# Altium project FPGA_ADC_SHIELD_PCB2.PrjPcb
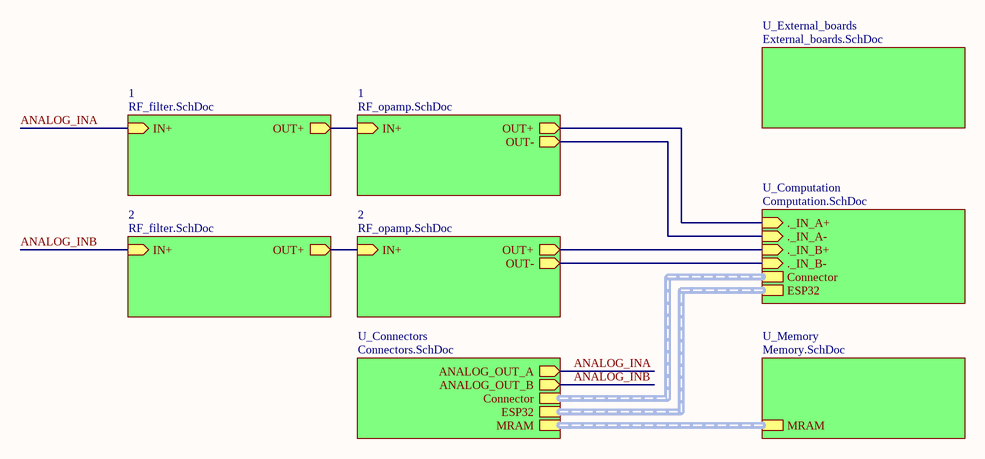
[diagram p0: Main.SchDoc]
7 sheets, 94 parts. Net scope: hierarchical (ports join the sheet entries above them; power ports are global).
Board file: MainBoard.PcbDoc
Sheets:
  Main.SchDoc
    1 = RF_filter.SchDoc
    1 = RF_opamp.SchDoc
    2 = RF_filter.SchDoc
    2 = RF_opamp.SchDoc
    U_Connectors = Connectors.SchDoc
    U_Computation = Computation.SchDoc
    U_Memory = Memory.SchDoc
    U_External_boards = External_boards.SchDoc

## Sheet Main.SchDoc
size A4; SheetNumber: 1; SheetTotal: 7

### Sub-sheets
1 = RF_filter.SchDoc: IN+ (in), OUT+ (out)
1 = RF_opamp.SchDoc: IN+ (in), OUT+ (out), OUT- (out)
2 = RF_filter.SchDoc: IN+ (in), OUT+ (out)
2 = RF_opamp.SchDoc: IN+ (in), OUT+ (out), OUT- (out)
U_Computation = Computation.SchDoc: ._IN_B+ (in), ._IN_B- (in), ._IN_A+ (in), ._IN_A- (in), Connector (harness Connector), ESP32 (harness *)
U_Connectors = Connectors.SchDoc: ANALOG_OUT_A (out), ANALOG_OUT_B (out), Connector (harness Connector), MRAM (harness MRAM), ESP32 (harness *)
U_External_boards = External_boards.SchDoc: no entries
U_Memory = Memory.SchDoc: MRAM (harness MRAM)

### Nets
ANALOG_INA: sheet 1/IN+, sheet U_Connectors/ANALOG_OUT_A
ANALOG_INB: sheet 2/IN+, sheet U_Connectors/ANALOG_OUT_B
NetC24_1_2: sheet 1/OUT+, sheet 1/IN+
NetC24_2_2: sheet 2/OUT+, sheet 2/IN+
NetC25_1_1: sheet 1/OUT+, sheet U_Computation/._IN_A+
NetC25_2_1: sheet 2/OUT+, sheet U_Computation/._IN_B+
NetC26_1_2: sheet 1/OUT-, sheet U_Computation/._IN_A-
NetC26_2_2: sheet 2/OUT-, sheet U_Computation/._IN_B-

### Buses and harness runs
harness sheet U_Computation/Connector = sheet U_Connectors/Connector
harness sheet U_Computation/ESP32 = sheet U_Connectors/ESP32
harness sheet U_Connectors/MRAM = sheet U_Memory/MRAM

## Sheet RF_filter.SchDoc
size A4; SheetNumber: 4; SheetTotal: 7
Used 2 times, as channels 1, 2. Parts and nets are listed once, with the designators drawn on the sheet.
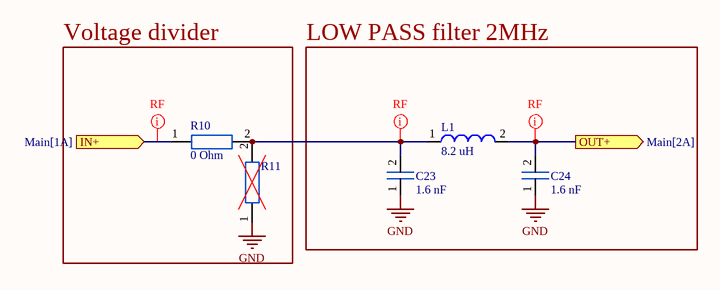
[diagram p1: RF_filter.SchDoc]

### Parts
C23  1.6 nF  [0402_footprint]
C24  1.6 nF  [0402_footprint]
L1  8.2 uH  [0603_FOOTPRINT]
R10  0 Ohm  [0402_footprint]
R11  (no value)  [0402_footprint]

### Blocks framed on the sheet
Voltage divider: R10 R11
LOW PASS filter 2MHz: C23 C24 L1

### Ports
IN+ (in, see Main[1A]), OUT+ (out, see Main[2A])

### Nets
GND: C23.1 C24.1 R11.1
IN+: R10.1 ; port IN+
OUT+: C24.2 L1.2 ; port OUT+
NetC23_2: C23.2 L1.1 R10.2 R11.2

### Channels
1: designators end in _1; ports IN+=ANALOG_INA OUT+=NetC24_1_2
2: designators end in _2; ports IN+=ANALOG_INB OUT+=NetC24_2_2

### Layout directives
net class RF: ANALOG_INA, NetC23_1_2, NetC24_1_2

### Library data of the parts
C23 C24 = Capacitor_0402: 0402 capacitor
L1 = Inductor_0603: 0603 inductor
R10 R11 = Resistor_0402

## Sheet RF_opamp.SchDoc
size A4; SheetNumber: 5; SheetTotal: 7
Used 2 times, as channels 1, 2. Parts and nets are listed once, with the designators drawn on the sheet.
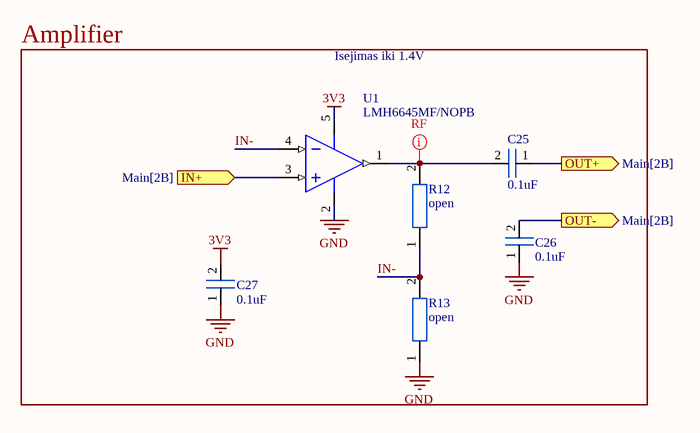
[diagram p2: RF_opamp.SchDoc]

### Parts
C25  0.1uF  [0402_footprint]
C26  0.1uF  [0402_footprint]
C27  0.1uF  [0402_footprint]
R12  open  [0402_footprint]
R13  open  [0402_footprint]
U1  LMH6645MF/NOPB  [DBV0005A_N]

### Ports
IN+ (in, see Main[2B]), OUT+ (out, see Main[2B]), OUT- (out, see Main[2B])

### Nets
3V3: C27.2 U1.5(V+)
GND: C26.1 C27.1 R13.1 U1.2(V-)
IN+: U1.3(IN+) ; port IN+
IN-: R12.1 R13.2 U1.4(IN-)
OUT+: C25.1 ; port OUT+
OUT-: C26.2 ; port OUT-
NetC25_2: C25.2 R12.2 U1.1(OUT)

### Channels
1: designators end in _1; ports IN+=NetC24_1_2 OUT+=NetC25_1_1 OUT-=NetC26_1_2
2: designators end in _2; ports IN+=NetC24_2_2 OUT+=NetC25_2_1 OUT-=NetC26_2_2

### Layout directives
net class RF: NetC25_1_2

### Notes on the sheet
- Amplifier
- Isejimas iki 1.4V

### Library data of the parts
C25-C27 = Capacitor_0402: 0402 capacitor
R12 R13 = Resistor_0402
U1 = CMP-0055-01245-3: 2.7V, 650uA, 65MHz, Rail-to-Rail Input and Output Amplifiers with Shutdown Option, 5-pin SOT-23, Pb-Free; Manufacturer: Texas Instruments; PowerWise: Y; PackageTopMarking: A68A*XTT; Package Reference: DBV0005A; PackageDescription: Molded SOT-23, .115 x .063 x .040 in Body, 5 Lead, .0375 in Pitch; ComponentLink1URL: http://www.ti.com/general/docs/lit/getliterature.tsp?genericPartNumber=LMH6645&fileType=pdf; CompType: Amplifiers; PinCount: 5; RoHS: Y; ComponentLink1Description: Datasheet URL

## Sheet Connectors.SchDoc
size A4; SheetNumber: 2; SheetTotal: 7
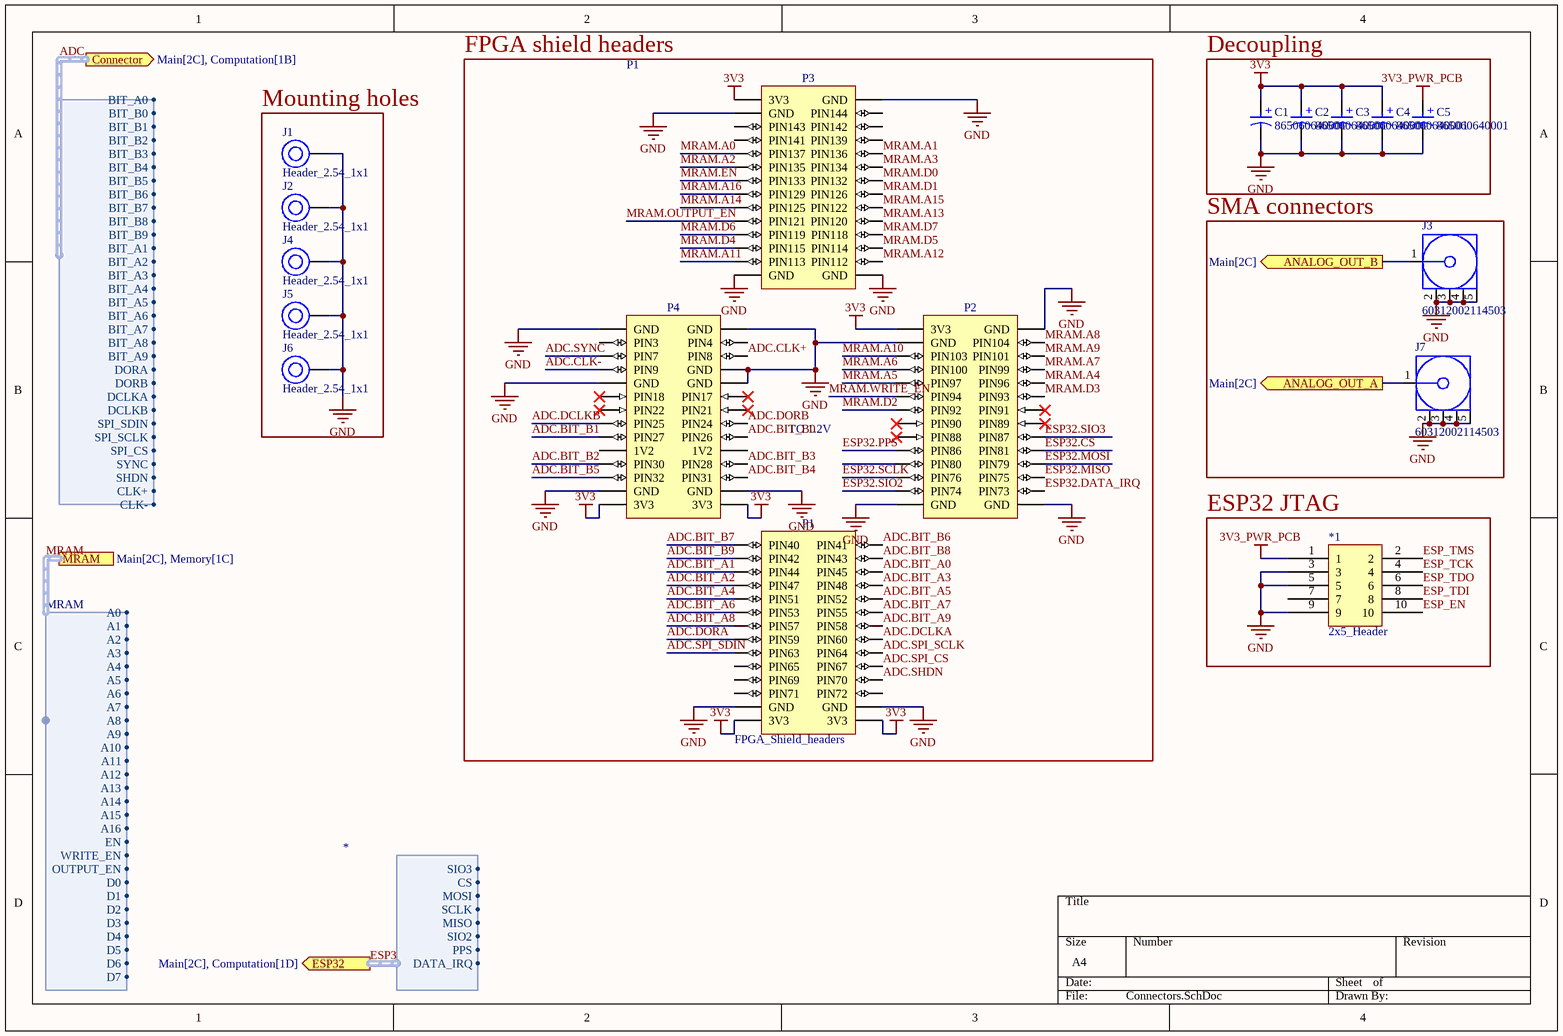
[diagram p3: Connectors.SchDoc]

### Parts
*1  2x5_Header  [2x5_HEADER]
C1  865060640001  [WCAP-ASLL_D4H5.5]
C2  865060640001  [WCAP-ASLL_D4H5.5]
C3  865060640001  [WCAP-ASLL_D4H5.5]
C4  865060640001  [WCAP-ASLL_D4H5.5]
C5  865060640001  [WCAP-ASLL_D4H5.5]
J1  Header_2.54_1x1  [HEADER_2.54_1x1]
J2  Header_2.54_1x1  [HEADER_2.54_1x1]
J3  60312002114503  [60312002114503]
J4  Header_2.54_1x1  [HEADER_2.54_1x1]
J5  Header_2.54_1x1  [HEADER_2.54_1x1]
J6  Header_2.54_1x1  [HEADER_2.54_1x1]
J7  60312002114503  [60312002114503]
P1  FPGA_Shield_headers  [FPGA_SHIELD_HEADER_FOOTPRINT]

### Blocks framed on the sheet
FPGA shield headers: P1
Decoupling: C1-C5
Mounting holes: J1 J2 J4-J6
SMA connectors: J3 J7
ESP32 JTAG: *1

### Ports
ANALOG_OUT_A (out, see Main[2C]), ANALOG_OUT_B (out, see Main[2C]), Connector (out, harness Connector, see Main[2C], Computation[1B]), ESP32 (out, harness *, see Main[2C], Computation[1D]), MRAM (harness MRAM, see Main[2C], Memory[1C])

### Harnesses
Connector: BIT_B1, BIT_B2, BIT_B3, BIT_B4, BIT_B5, BIT_B6, BIT_B7, BIT_B8, BIT_B9, BIT_A1, BIT_A2, BIT_A3, BIT_A4, BIT_A5, BIT_A6, BIT_A7, BIT_A8, BIT_A9, DORA, DORB, DCLKA, DCLKB, SPI_SDIN, SPI_SCLK, SPI_CS, SYNC, SHDN, BIT_B0, BIT_A0, CLK+, CLK-
MRAM: A0, A1, A2, A3, A4, A5, A6, A7, A8, A9, A10, A11, A12, A13, A14, A15, A16, EN, WRITE_EN, OUTPUT_EN, D0, D1, D2, D3, D4, D5, D6, D7
*: SIO3, CS, MOSI, SCLK, MISO, SIO2, PPS, DATA_IRQ

### Nets
3V3: C1.1(P) C2.1(P) C3.1(P) C4.1(P) P1.27(3V3) P1.28(3V3) P1.29(3V3) P1.57(3V3) P1.111(3V3) P1.112(3V3)
3V3_PWR_PCB: *1.1 C5.1(P)
GND: *1.3 *1.5 *1.9 C1.2(N) C2.2(N) C3.2(N) C4.2(N) C5.2(N) J1.0 J2.0 J3.2(GND) J3.3(GND) J3.4(GND) J3.5(GND) J4.0 J5.0 J6.0 J7.2(GND) J7.3(GND) J7.4(GND) J7.5(GND) P1.1(GND) P1.2(GND) P1.8(GND) P1.9(GND) P1.10(GND) P1.25(GND) P1.26(GND) P1.30(GND) P1.31(GND) P1.55(GND) P1.56(GND) P1.58(GND) P1.59(GND) P1.83(GND) P1.84(GND) P1.109(GND) P1.110(GND)
ADC.BIT_A0: P1.90(PIN45)
ADC.BIT_A1: P1.89(PIN44)
ADC.BIT_A2: P1.91(PIN47)
ADC.BIT_A3: P1.92(PIN48)
ADC.BIT_A4: P1.93(PIN51)
ADC.BIT_A5: P1.94(PIN52)
ADC.BIT_A6: P1.95(PIN53)
ADC.BIT_A7: P1.96(PIN55)
ADC.BIT_A8: P1.97(PIN57)
ADC.BIT_A9: P1.98(PIN58)
ADC.BIT_B0: P1.18(PIN26)
ADC.BIT_B1: P1.17(PIN27)
ADC.BIT_B2: P1.21(PIN30)
ADC.BIT_B3: P1.22(PIN28)
ADC.BIT_B4: P1.24(PIN31)
ADC.BIT_B5: P1.23(PIN32)
ADC.BIT_B6: P1.86(PIN41)
ADC.BIT_B7: P1.85(PIN40)
ADC.BIT_B8: P1.88(PIN43)
ADC.BIT_B9: P1.87(PIN42)
ADC.CLK+: P1.6(PIN8)
ADC.CLK-: P1.7(PIN9)
ADC.DCLKA: P1.100(PIN60)
ADC.DCLKB: P1.15(PIN25)
ADC.DORA: P1.99(PIN59)
ADC.DORB: P1.16(PIN24)
ADC.SHDN: P1.106(PIN70)
ADC.SPI_CS: P1.104(PIN67)
ADC.SPI_SCLK: P1.102(PIN64)
ADC.SPI_SDIN: P1.101(PIN63)
ADC.SYNC: P1.5(PIN7)
ANALOG_INA: J7.1(Signal) ; port ANALOG_OUT_A
ANALOG_INB: J3.1(Signal) ; port ANALOG_OUT_B
ESP32.CS: P1.76(PIN81)
ESP32.DATA_IRQ: P1.82(PIN73)
ESP32.MISO: P1.80(PIN75)
ESP32.MOSI: P1.78(PIN79)
ESP32.PPS: P1.75(PIN86)
ESP32.SCLK: P1.79(PIN76)
ESP32.SIO2: P1.81(PIN74)
ESP32.SIO3: P1.74(PIN87)
ESP_EN: *1.10
ESP_TCK: *1.4
ESP_TDI: *1.8
ESP_TDO: *1.6
ESP_TMS: *1.2
MRAM.A0: P1.37(PIN137)
MRAM.A1: P1.38(PIN136)
MRAM.A2: P1.39(PIN135)
MRAM.A3: P1.40(PIN134)
MRAM.A4: P1.66(PIN96)
MRAM.A5: P1.65(PIN97)
MRAM.A6: P1.63(PIN100)
MRAM.A7: P1.64(PIN99)
MRAM.A8: P1.60(PIN104)
MRAM.A9: P1.62(PIN101)
MRAM.A10: P1.61(PIN103)
MRAM.A11: P1.53(PIN113)
MRAM.A12: P1.54(PIN112)
MRAM.A13: P1.48(PIN120)
MRAM.A14: P1.45(PIN125)
MRAM.A15: P1.46(PIN122)
MRAM.A16: P1.43(PIN129)
MRAM.D0: P1.42(PIN132)
MRAM.D1: P1.44(PIN126)
MRAM.D2: P1.69(PIN92)
MRAM.D3: P1.68(PIN93)
MRAM.D4: P1.51(PIN115)
MRAM.D5: P1.52(PIN114)
MRAM.D6: P1.49(PIN119)
MRAM.D7: P1.50(PIN118)
MRAM.EN: P1.41(PIN133)
MRAM.OUTPUT_EN: P1.47(PIN121)
MRAM.WRITE_EN: P1.67(PIN94)

Not connected (* = marked no-connect by the designer): *1 7; P1 3(PIN3) 4(PIN4) 11(PIN18)* 12(PIN17)* 13(PIN22)* 14(PIN21)* 19(1V2) 20(1V2) 32(PIN144) 33(PIN143) 34(PIN142) 35(PIN141) 36(PIN139) 70(PIN91)* 71(PIN90)* 72(PIN89)* 73(PIN88)* 77(PIN80) 103(PIN65) 105(PIN69) 107(PIN71) 108(PIN72)

### Buses and harness runs
harness ADC = port Connector
harness ESP32 = port ESP32
harness MRAM = port MRAM

### Notes on the sheet
- (near P1) TO 1.2V
- (in symbol CMP-03913-53914524-1) +

### Library data of the parts
C1-C5 = CMP-03913-53914524-1: 865060640001 WCAP-ASLL Aluminum Electrolytic Capacitors; Life (Hours): 2000hours; Polarity: Polar; Voltage Rating: 50V; Leakage Current: 3µA; Capacitance: 1µF; Ripple Current: 60mA; Tolerance: 20%; Insulation Resistance: 16.6667MΩ; Impedance: 4.4Ω; Min Operating Temperature: -55°C; NexarPartId: 53914524; Height - Seated (Max): 5.5118mm; Height: 5.5mm; Max Operating Temperature: 105°C; Length: 5.5mm; RoHS: Compliant; Voltage Rating (DC): 50V; Mount: Surface Mount; Ripple Current (AC): 60mA; Case/Package: Radial; Packaging: Tape & Reel (TR); Diameter: 4mm; REACH SVHC: Unknown
  C1: ComponentLink1Description: Buy; ComponentLink1URL: https://www.we-online.com/en/components/products/WCAP-ASLL#/articles/WCAP_ASLL_SIZE_4
J1 J2 J4-J6 = Header_2.54_1x1: Header 1x1
J3 J7 = CMP-207975-000002-2: SMA PCB THT JACK STRAIGHT WR-SMA; NexarPartId: 97004423; Insertion Loss (dB): 0.14dB; Number of Contacts: 1; Voltage Rating: 335V; Impedance: 50Ω; Frequency: 18GHz; Dielectric Material: PTFE; Insulation Resistance: 5GΩ; Orientation: Straight; Contact Material: Gold, Nickel; Min Operating Temperature: -65°C; Insulation Material: PTFE; Connector Type: SMA; Max Operating Temperature: 165°C; Height: 9.76mm

## Sheet Computation.SchDoc
size A4; SheetNumber: 3; SheetTotal: 7
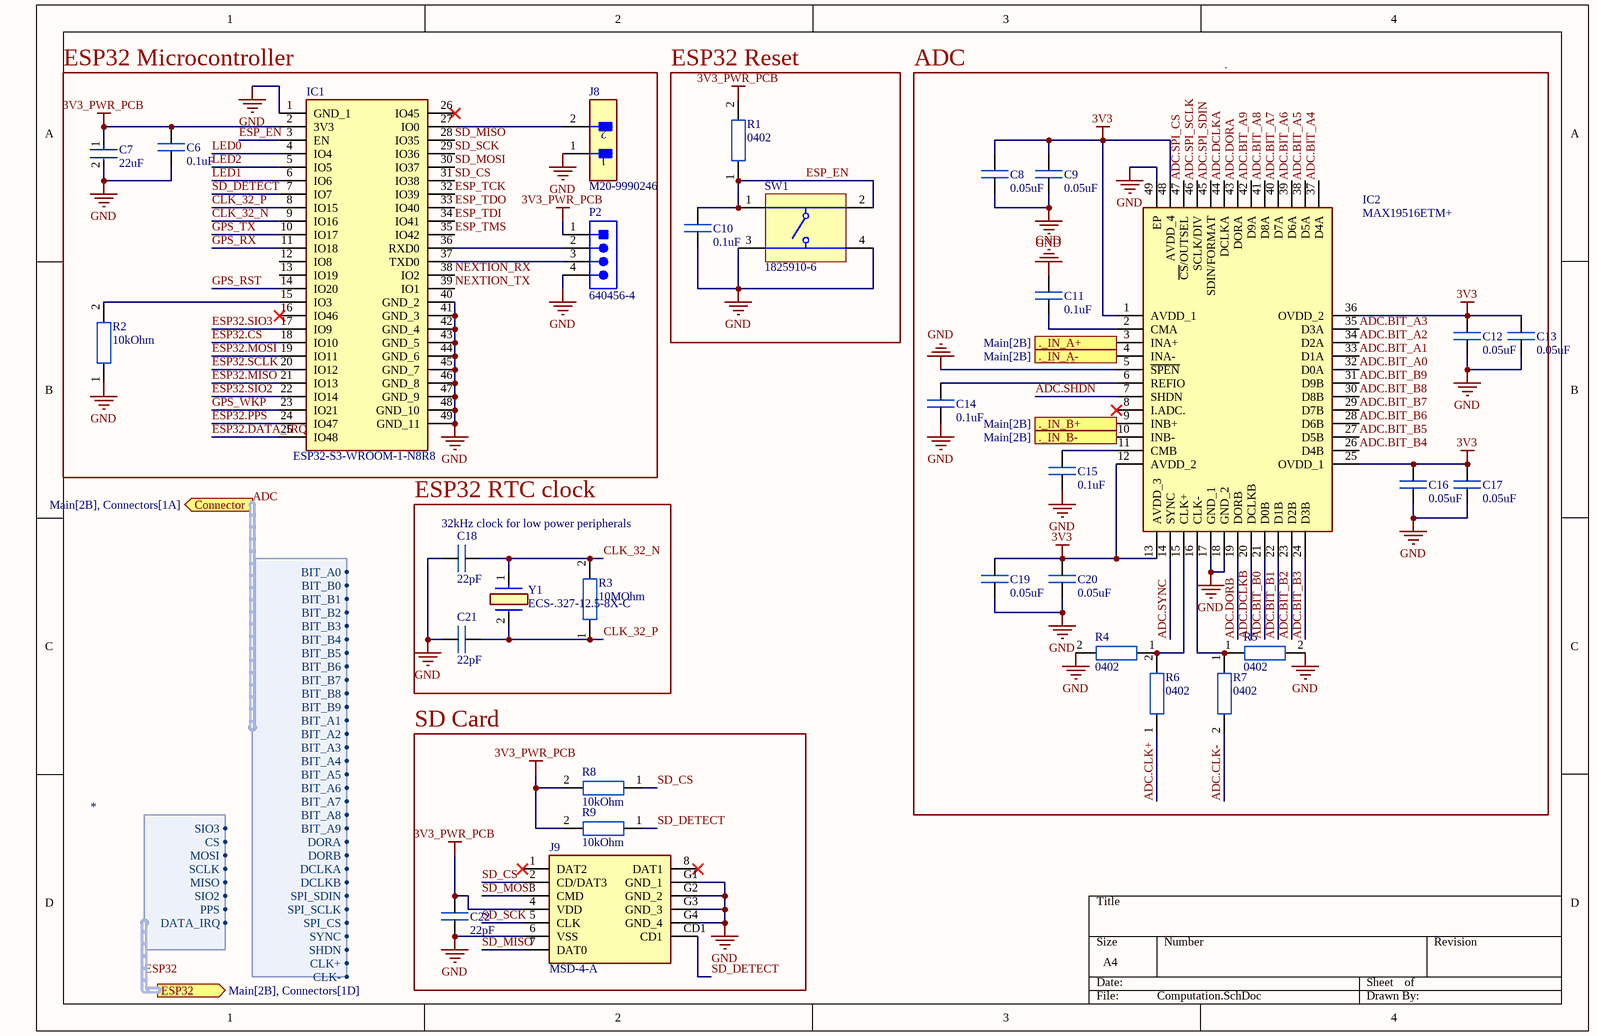
[diagram p4: Computation.SchDoc]

### Parts
C6  0.1uF  [0402_footprint]
C7  22uF  [FP-CL21-IPC_B]
C8  0.05uF  [0402_footprint]
C9  0.05uF  [0402_footprint]
C10  0.1uF  [0402_footprint]
C11  0.1uF  [0402_footprint]
C12  0.05uF  [0402_footprint]
C13  0.05uF  [0402_footprint]
C14  0.1uF  [0402_footprint]
C15  0.1uF  [0402_footprint]
C16  0.05uF  [0402_footprint]
C17  0.05uF  [0402_footprint]
C18  22pF  [0402_footprint]
C19  0.05uF  [0402_footprint]
C20  0.05uF  [0402_footprint]
C21  22pF  [0402_footprint]
C22  22pF  [0402_footprint]
IC1  ESP32-S3-WROOM-1-N8R8  [ESP32S3WROOM1N8R8]
IC2  MAX19516ETM+  [QFN50P700X700X80-49N]
J8  M20-9990246  [FP-M20-9990246-MFG]
J9  MSD-4-A  [MSD4A]
P2  640456-4  [TECO-640456-4]
R1  0402  [0402_footprint]
R2  10kOhm  [0402_footprint]
R3  10MOhm  [0402_footprint]
R4  0402  [0402_footprint]
R5  0402  [0402_footprint]
R6  0402  [0402_footprint]
R7  0402  [0402_footprint]
R8  10kOhm  [0402_footprint]
R9  10kOhm  [0402_footprint]
SW1  1825910-6  [TECO-1825910-6_V]
Y1  ECS-.327-12.5-8X-C  [ECS3271258XC]

### Blocks framed on the sheet
ESP32 Microcontroller: C6 C7 IC1 J8 P2 R2
ESP32 Reset: C10 R1 SW1
ADC: C8 C9 C11-C17 C19 C20 IC2 R4-R7
ESP32 RTC clock: C18 C21 R3 Y1
SD Card: C22 J9 R8 R9

### Ports
._IN_A+ (in, see Main[2B]), ._IN_A- (in, see Main[2B]), ._IN_B+ (in, see Main[2B]), ._IN_B- (in, see Main[2B]), Connector (out, harness Connector, see Main[2B], Connectors[1A]), ESP32 (out, harness *, see Main[2B], Connectors[1D])

### Harnesses
Connector: BIT_B1, BIT_B2, BIT_B3, BIT_B4, BIT_B5, BIT_B6, BIT_B7, BIT_B8, BIT_B9, BIT_A1, BIT_A2, BIT_A3, BIT_A4, BIT_A5, BIT_A6, BIT_A7, BIT_A8, BIT_A9, DORA, DORB, DCLKA, DCLKB, SPI_SDIN, SPI_SCLK, SPI_CS, SYNC, SHDN, BIT_B0, BIT_A0, CLK+, CLK-
*: SIO3, CS, MOSI, SCLK, MISO, SIO2, PPS, DATA_IRQ

### Nets
3V3: C8.2 C9.2 C12.2 C13.2 C16.2 C17.2 C19.2 C20.2 IC2.1(AVDD_1) IC2.12(AVDD_2) IC2.13(AVDD_3) IC2.25(OVDD_1) IC2.36(OVDD_2) IC2.48(AVDD_4)
3V3_PWR_PCB: C6.2 C7.1 C22.1 IC1.2(3V3) J9.4(VDD) P2.1 R1.2 R8.2 R9.2
GND: C6.1 C7.2 C8.1 C9.1 C10.1 C11.2 C12.1 C13.1 C14.1 C15.1 C16.1 C17.1 C18.2 C19.1 C20.1 C21.2 C22.2 IC1.1(GND_1) IC1.40(GND_2) IC1.41(GND_3) IC1.42(GND_4) IC1.43(GND_5) IC1.44(GND_6) IC1.45(GND_7) IC1.46(GND_8) IC1.47(GND_9) IC1.48(GND_10) IC1.49(GND_11) IC2.5(~{SPEN}) IC2.17(GND_1) IC2.18(GND_2) IC2.49(EP) J8.1 J9.6(VSS) J9.G1(GND_1) J9.G2(GND_2) J9.G3(GND_3) J9.G4(GND_4) P2.4 R2.1 R4.2 R5.2 SW1.3 SW1.4
ADC.BIT_A0: IC2.32(D0A)
ADC.BIT_A1: IC2.33(D1A)
ADC.BIT_A2: IC2.34(D2A)
ADC.BIT_A3: IC2.35(D3A)
ADC.BIT_A4: IC2.37(D4A)
ADC.BIT_A5: IC2.38(D5A)
ADC.BIT_A6: IC2.39(D6A)
ADC.BIT_A7: IC2.40(D7A)
ADC.BIT_A8: IC2.41(D8A)
ADC.BIT_A9: IC2.42(D9A)
ADC.BIT_B0: IC2.21(D0B)
ADC.BIT_B1: IC2.22(D1B)
ADC.BIT_B2: IC2.23(D2B)
ADC.BIT_B3: IC2.24(D3B)
ADC.BIT_B4: IC2.26(D4B)
ADC.BIT_B5: IC2.27(D5B)
ADC.BIT_B6: IC2.28(D6B)
ADC.BIT_B7: IC2.29(D7B)
ADC.BIT_B8: IC2.30(D8B)
ADC.BIT_B9: IC2.31(D9B)
ADC.CLK+: R6.1
ADC.CLK-: R7.2
ADC.DCLKA: IC2.44(DCLKA)
ADC.DCLKB: IC2.20(DCLKB)
ADC.DORA: IC2.43(DORA)
ADC.DORB: IC2.19(DORB)
ADC.SHDN: IC2.7(SHDN)
ADC.SPI_CS: IC2.47(~{CS}/OUTSEL)
ADC.SPI_SCLK: IC2.46(SCLK/DIV)
ADC.SPI_SDIN: IC2.45(SDIN/FORMAT)
ADC.SYNC: IC2.14(SYNC)
CLK_32_N: C18.1 IC1.9(IO16) R3.2 Y1.1(X1)
CLK_32_P: C21.1 IC1.8(IO15) R3.1 Y1.2(X2)
ESP32.CS: IC1.18(IO10)
ESP32.DATA_IRQ: IC1.25(IO48)
ESP32.MISO: IC1.21(IO13)
ESP32.MOSI: IC1.19(IO11)
ESP32.PPS: IC1.24(IO47)
ESP32.SCLK: IC1.20(IO12)
ESP32.SIO2: IC1.22(IO14)
ESP32.SIO3: IC1.17(IO9)
ESP_EN: C10.2 IC1.3(EN) R1.1 SW1.1 SW1.2
ESP_TCK: IC1.32(IO39)
ESP_TDI: IC1.34(IO41)
ESP_TDO: IC1.33(IO40)
ESP_TMS: IC1.35(IO42)
GPS_RST: IC1.14(IO20)
GPS_RX: IC1.11(IO18)
GPS_TX: IC1.10(IO17)
GPS_WKP: IC1.23(IO21)
LED0: IC1.4(IO4)
LED1: IC1.6(IO6)
LED2: IC1.5(IO5)
NEXTION_RX: IC1.38(IO2)
NEXTION_TX: IC1.39(IO1)
SD_CS: IC1.31(IO38) J9.2(CD/DAT3) R8.1
SD_DETECT: IC1.7(IO7) J9.CD1 R9.1
SD_MISO: IC1.28(IO35) J9.7(DAT0)
SD_MOSI: IC1.30(IO37) J9.3(CMD)
SD_SCK: IC1.29(IO36) J9.5(CLK)
NetC11_1: C11.1 IC2.2(CMA)
NetC14_2: C14.2 IC2.6(REFIO)
NetC15_2: C15.2 IC2.11(CMB)
NetC25_1_1: IC2.3(INA+) ; port ._IN_A+
NetC25_2_1: IC2.9(INB+) ; port ._IN_B+
NetC26_1_2: IC2.4(INA-) ; port ._IN_A-
NetC26_2_2: IC2.10(INB-) ; port ._IN_B-
NetIC1_15: IC1.15(IO3) R2.2
NetIC1_27: IC1.27(IO0) J8.2
NetIC1_36: IC1.36(RXD0) P2.2
NetIC1_37: IC1.37(TXD0) P2.3
NetIC2_15: IC2.15(CLK+) R4.1 R6.2
NetIC2_16: IC2.16(CLK-) R5.1 R7.1

Not connected (* = marked no-connect by the designer): IC1 12(IO8) 13(IO19) 16(IO46)* 26(IO45)*; IC2 8(I.ADC.)*; J9 1(DAT2)* 8(DAT1)*

### Buses and harness runs
harness ADC = port Connector
harness ESP32 = port ESP32

### Notes on the sheet
- .
- (near C18) 32kHz clock for low power peripherals

### Library data of the parts
C6 C8-C22 = Capacitor_0402: 0402 capacitor
C7 = CMP-13271-002087-1: CL21 Series 0805 22uF 6.3V ±20% Tolerance X5R Multilayer Ceramic Chip Capacitor; Max Operating Temperature: 85°C; Voltage Rating (DC): 6.3V; Thickness: 0.055inch; Packaging: Tape and Reel; Min Operating Temperature: -55°C; Depth: 1.25mm; Case/Package: 0805; Length: 2mm; Mount: Surface Mount; Width: 0.049inch; Radiation Hardening: No; Voltage Rating: 6.3V; Height: 1.25mm; Tolerance: 20%; Lead Free: Lead Free; Capacitance: 22uF; Package Quantity: 10000; Dielectric: X5R; ComponentLink1Description: Buy; ComponentLink1URL: https://www.mouser.lt/ProductDetail/Samsung-Electro-Mechanics/CL21A226MQQNNNF?qs=sGAEpiMZZMt7gvpyg0xT8gpCc%252Bo5qKWQjwV5CjV5FSg%3D
IC1 = ESP32-S3-WROOM-1-N8R8: Integrated Circuit; Manufacturer_Name: Espressif Systems; Datasheet Link: https://www.espressif.com/sites/default/files/documentation/esp32-s3-wroom-1_wroom-1u_datasheet_en.pdf; Height: 3.25mm; Manufacturer_Part_Number: ESP32-S3-WROOM-1-N8R8; Mouser Part Number: 356-EP32S3WROOM1N8R8; Mouser Price/Stock: https://www.mouser.co.uk/ProductDetail/Espressif-Systems/ESP32-S3-WROOM-1-N8R8?qs=7D1LtPJG0i3%2F28hKFavOpQ%3D%3D; ComponentLink1Description: S3 datasheet; ComponentLink1URL: https://www.espressif.com/sites/default/files/documentation/esp32-s3_datasheet_en.pdf; ComponentLink2Description: Wroom datasheet; ComponentLink2URL: https://www.espressif.com/sites/default/files/documentation/esp32-s3-wroom-1_wroom-1u_datasheet_en.pdf; ComponentLink3Description: Reference manual; ComponentLink3URL: https://www.espressif.com/sites/default/files/documentation/esp32-s3_technical_reference_manual_en.pdf
IC2 = MAX19516ETM+: Integrated Circuit; Manufacturer_Name: Maxim Integrated; Datasheet Link: https://datasheets.maximintegrated.com/en/ds/MAX19516.pdf; Height: 0.8mm; Manufacturer_Part_Number: MAX19516ETM+; Mouser Part Number: 700-MAX19516ETM; Mouser Price/Stock: https://www.mouser.co.uk/ProductDetail/Maxim-Integrated/MAX19516ETM%2b/?qs=1THa7WoU59FJ2JI%2FsSE3dA%3D%3D
J8 = CMP-15831-000009-1: CONN HEADER VERT 2POS 2.54MM; Manufacturer: Harwin; Conn Gender: Male; Conn Orientation: Vertical; Number Of Contacts: 2; Current Rating: 3A; ComponentLink2URL: https://cdn.harwin.com/pdfs/M20-999.pdf; ComponentLink2Description: Datasheet; Package: M20-9990246; Temperature: -40°C to +105°C; Octopart: https://octopart.com/m20-9990246-harwin-2590635; Mouser Description: 2.54mm (0.1") Pitch SIL Vertical PC Tail Pin Header, 6.1mm mating pin height, tin, 2 contacts; Temperature Range High: +105°C; Device Class L1: Connectors; RoHS: TRUE; Automotive: No; Height: 8.99mm; Number Of Rows: 1; Contact Material: Tin,Nickel; Category: Conn; Pitch: 2.54mm; Lead Free: Yes; Digikey Description: CONN HEADER VERT 2POS 2.54MM; Manufacturer Part Number: M20-9990246; Temperature Range Low: -40°C; Device Class L3: unset; Device Class L2: Headers and Wire Housings
J9 = MSD-4-A: Connector; Manufacturer_Name: CUI Devices; Datasheet Link: https://www.cuidevices.com/product/resource/pdf/msd-4-a.pdf; Height: 2mm; Manufacturer_Part_Number: MSD-4-A
P2 = CMP-2000-05419-1: Male Header, Pitch 2.54 mm, 1 x 4 Position, Height 10.03 mm, Tail Length 3.56 mm, RoHS, Bulk; Manufacturer: TE Connectivity; Material, Housing: Polyester; Primary Type: InterconnectSystem; Mount Angle: Vertical; Color, Housing: White; Current, Rating: 5 / A; Agency Approvals: CSA,UL; Contact Termination Area Plating: Tin; Temperature, Operating: -55to+105 / degC; Standards: RoHSCompliant,ELVCompliant,UL94V-0; Number of Positions: 4; Brand/Series: MTA-100Series; Angle: Straight; Pin Spacing: 0.1 / "; Material, Contact: CopperAlloy; Connector Type: MTA-100; Special Features: Pinstrip; Mounting Hole Size: 0.04 / "; Contact Centerline Spacing: 0.100 / in.; Voltage, Rating: 250 / V; Manufacturer URL: http://www.te.com/; Length, Pin: 0.14 / "; Length, Overall: 0.4 / "; Color: White; Flammability Rating: UL94V-0; Mounting Type: PCMount; Termination: Solder; Datasheet URL: https://datasheet.ciiva.com/16286/eng-ds-82056-mta-0608-16286228.pdf; Number of Contacts: 4; Contact Shape: Square; Contact Mating Area Plating: Tin; Length, Terminal Post: 0.14 / in.; Size, Post: 0.025 / in.; Contact Plating: Tin; Type: PCBPlug; Datasheet Version: Dec-14; Number of Rows: 1
R1-R9 = Resistor_0402: 0402 resistor
SW1 = CMP-1684-00021-1: Tact Switch, SPST-NO, 0.05 A, -35 to 85 degC, 4-Pin THD, RoHS, Bulk; Manufacturer: TE Connectivity; Maximum Contact Resistance: 100mOhm; Mechanical Life: 100000Cycles; Bushing Type: Unthreaded; Switch Configuration: OFF(ON); Maximum DC Voltage Rating: 24V; Contact Rating @ Voltage: 0.05A@24VDC; Actuator Color: Black; Body Orientation: Straight; Function: MomentaryContact; Illumination: N/R; Actuator Style: RoundButton; Actuator Material: PolybutyleneTerephthalate; Dielectric Strength: 500VAC; Pole Throw Configuration: SPST; Actuator Length: 1.4mm; Product Weight: N/A; Contact Material: CopperAlloy; Housing Material: N/A; Terminal Type: PCPins; Minimum Insulation Resistance: 100MOhm; Package Description: 4-Pin Through Hole Device, Body 5.99 x 5.99 mm, Pitch 6.5 mm; Part No: 1825910-6; Package Reference: THD; Base Material: N/A; Manufacturer URL: http://www.te.com; Contact Plating: Silver; RoHS: Yes; Datasheet Version: Rev. C9; Electrical Life: 100000Cycles; Maximum AC Voltage Rating: N/A; Thread Size: N/R; Operating Temperature: -35to85C; Mounting: ThroughHole; Dimension: 5.99x5mm; Datasheet URL: http://www.te.com/commerce/DocumentDelivery/DDEController?Action=showdoc&DocId=Customer+Drawing%7F1825910%7FC9%7Fpdf%7FEnglish%7FENG_CD_1825910_C9.pdf%7F1825910-6; Family: 1825910; Seal Location: N/A; Seal Description: N/A; Packaging: N/A
Y1 = ECS-.327-12.5-8X-C: Crystal or Oscillator; Manufacturer_Name: ECS; Datasheet Link: https://www.mouser.in/datasheet/2/122/ECS__327_12_5_13X_C-1919094.pdf; Height: 6.2mm; Manufacturer_Part_Number: ECS-.327-12.5-8X-C; Mouser Part Number: 520-ECS-327-12.58X-C; Mouser Price/Stock: https://www.mouser.co.uk/ProductDetail/ECS/ECS-.327-12.5-8X-C?qs=vmHwEFxEFR8ooxxsTMgFbw%3D%3D; ComponentLink1Description: Buy; ComponentLink1URL: https://www.mouser.lt/ProductDetail/ECS/ECS-.327-12.5-8X-C?qs=vmHwEFxEFR8ooxxsTMgFbw%3D%3D; ComponentLink2Description: Datasheet; ComponentLink2URL: https://www.mouser.lt/datasheet/2/122/ECS-.327-12.5-8X-C-1841202.pdf

## Sheet Memory.SchDoc
size A4; SheetNumber: 6; SheetTotal: 7
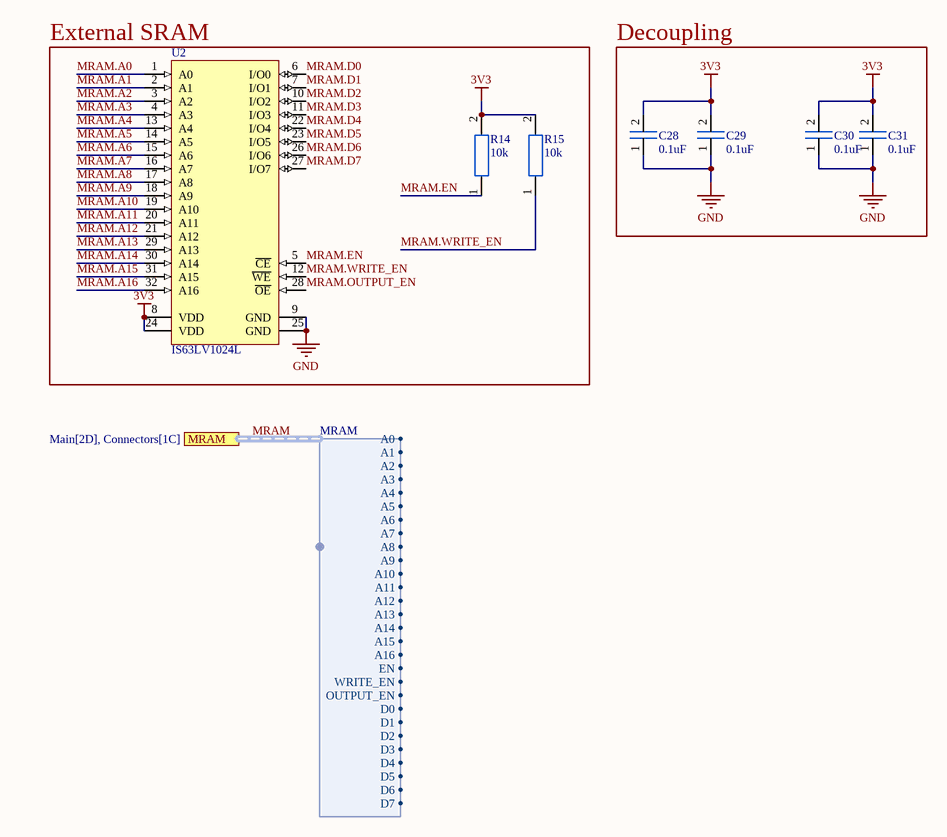
[diagram p5: Memory.SchDoc]

### Parts
C28  0.1uF  [0402_footprint]
C29  0.1uF  [0402_footprint]
C30  0.1uF  [0402_footprint]
C31  0.1uF  [0402_footprint]
R14  10k  [0402_footprint]
R15  10k  [0402_footprint]
U2  IS63LV1024L  [ISSI-TSOP-2-32_N]

### Blocks framed on the sheet
External SRAM: R14 R15 U2
Decoupling: C28-C31

### Ports
MRAM (harness MRAM, see Main[2D], Connectors[1C])

### Harnesses
MRAM: A0, A1, A2, A3, A4, A5, A6, A7, A8, A9, A10, A11, A12, A13, A14, A15, A16, EN, WRITE_EN, OUTPUT_EN, D0, D1, D2, D3, D4, D5, D6, D7

### Nets
3V3: C28.2 C29.2 C30.2 C31.2 R14.2 R15.2 U2.8(VDD) U2.24(VDD)
GND: C28.1 C29.1 C30.1 C31.1 U2.9(GND) U2.25(GND)
MRAM.A0: U2.1(A0)
MRAM.A1: U2.2(A1)
MRAM.A2: U2.3(A2)
MRAM.A3: U2.4(A3)
MRAM.A4: U2.13(A4)
MRAM.A5: U2.14(A5)
MRAM.A6: U2.15(A6)
MRAM.A7: U2.16(A7)
MRAM.A8: U2.17(A8)
MRAM.A9: U2.18(A9)
MRAM.A10: U2.19(A10)
MRAM.A11: U2.20(A11)
MRAM.A12: U2.21(A12)
MRAM.A13: U2.29(A13)
MRAM.A14: U2.30(A14)
MRAM.A15: U2.31(A15)
MRAM.A16: U2.32(A16)
MRAM.D0: U2.6(I/O0)
MRAM.D1: U2.7(I/O1)
MRAM.D2: U2.10(I/O2)
MRAM.D3: U2.11(I/O3)
MRAM.D4: U2.22(I/O4)
MRAM.D5: U2.23(I/O5)
MRAM.D6: U2.26(I/O6)
MRAM.D7: U2.27(I/O7)
MRAM.EN: R14.1 U2.5(~{CE})
MRAM.OUTPUT_EN: U2.28(~{OE})
MRAM.WRITE_EN: R15.1 U2.12(~{WE})

### Buses and harness runs
harness MRAM = port MRAM

### Library data of the parts
C28-C31 = Capacitor_0402: 0402 capacitor
R14 R15 = Resistor_0402
U2 = CMP-0513-00267-1: 1 M High Speed Asynchronous CMOS SRAM with ECC, 128 K x 8, -40 to 85 degC, 32-Pin SOP (TSOP-2-32), Pb-Free; Manufacturer: Integrated Silicon Solution Inc (ISSI); PartNumber: IS61WV1288EEBLL-10TLI; Speed (ns): 10; Packing: Tray / Tube; Density: 1M; Organization: 128K x 8; ComponentLink2URL: https://www.mouser.lt/datasheet/2/198/63LV1024_L-258513.pdf; Mounting Technology: Surface Mount; PackageReference: TSOP-2-32; ComponentLink1Description: Buy; DatasheetVersion: Rev. A; ComponentLink1URL: https://www.mouser.lt/ProductDetail/ISSI/IS63LV1024L-10TLI?qs=sGAEpiMZZMtm4RFapVkzrE09Sz2U0bpYMMQofUUKL3Q%3D; RoHS: Pb-Free; ComponentLink2Description: Datasheet; PackageDescription: 32-Pin 400 mil TSOP-2, Body 20.95 x 10.16 mm, Pitch 1.27 mm; PackageVersion: Rev. E, 06/2009

## Sheet External_boards.SchDoc
size A4; SheetNumber: 7; SheetTotal: 7
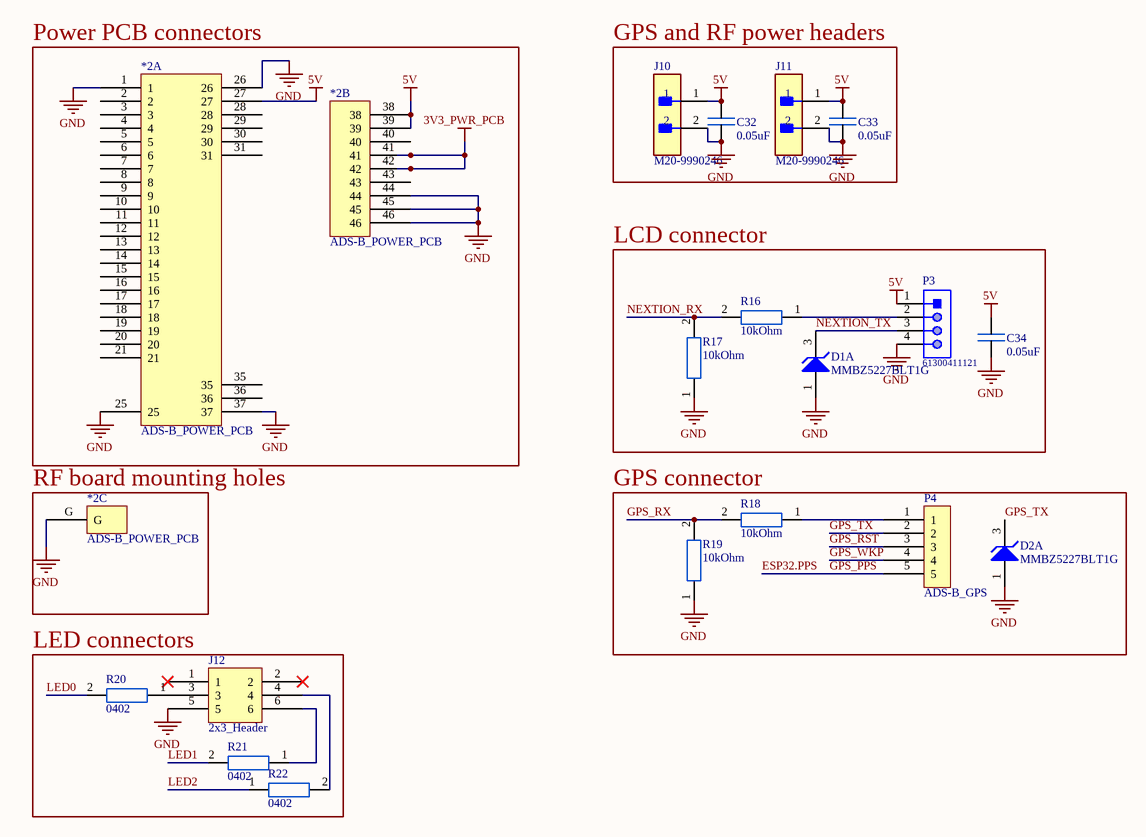
[diagram p6: External_boards.SchDoc]

### Parts
*2  ADS-B_POWER_PCB  [ADS-B_POWER_PCB]  (parts A,B,C of 3)
C32  0.05uF  [0402_footprint]
C33  0.05uF  [0402_footprint]
C34  0.05uF  [0402_footprint]
D1  MMBZ5227BLT1G  [ONSC-SOT-23-3-318-08_V]  (part A of 2)
D2  MMBZ5227BLT1G  [ONSC-SOT-23-3-318-08_V]  (part A of 2)
J10  M20-9990246  [FP-M20-9990246-MFG]
J11  M20-9990246  [FP-M20-9990246-MFG]
J12  2x3_Header  [2x3 header]
P3  61300411121  [61300411121]
P4  ADS-B_GPS  [ADS-B_GPS]
R16  10kOhm  [0402_footprint]
R17  10kOhm  [0402_footprint]
R18  10kOhm  [0402_footprint]
R19  10kOhm  [0402_footprint]
R20  0402  [0402_footprint]
R21  0402  [0402_footprint]
R22  0402  [0402_footprint]

### Blocks framed on the sheet
Power PCB connectors: *2
GPS and RF power headers: C32 C33 J10 J11
LCD connector: C34 D1 P3 R16 R17
RF board mounting holes: *2
GPS connector: D2 P4 R18 R19
LED connectors: J12 R20-R22

### Nets
3V3_PWR_PCB: *2.41 *2.42
5V: *2.27 *2.38 *2.39 C32.2 C33.2 C34.2 J10.1 J11.1 P3.1
GND: *2.1 *2.25 *2.26 *2.37 *2.44 *2.45 *2.46 *2.G C32.1 C33.1 C34.1 D1.1(A) D2.1(A) J10.2 J11.2 J12.5 P3.4 R17.1 R19.1
ESP32.PPS: P4.5  [also labelled GPS_PPS]
GPS_RST: P4.3
GPS_RX: R18.2 R19.2
GPS_TX: D2.3(K) P4.2
GPS_WKP: P4.4
LED0: R20.2
LED1: R21.2
LED2: R22.1
NEXTION_RX: R16.2 R17.2
NEXTION_TX: D1.3(K) P3.3
NetJ12_3: J12.3 R20.1
NetJ12_4: J12.4 R22.2
NetJ12_6: J12.6 R21.1
NetP3_2: P3.2 R16.1
NetP4_1: P4.1 R18.1

Not connected (* = marked no-connect by the designer): *2 2 3 4 5 6 7 8 9 10 11 12 13 14 15 16 17 18 19 20 21 28 29 30 31 35 36 40 43; J12 1* 2*

### Library data of the parts
C32-C34 = Capacitor_0402: 0402 capacitor
D1 D2 = CMP-1060-00983-1: Zener Voltage Regulator, 225 mW, 3-Pin SOT-23, Pb-Free, Tape and Reel; Manufacturer: On Semiconductor; VZ Typ (V): 3.6; ComponentLink1URL: http://www.onsemi.com/; ComponentLink1Description: Manufacturer URL; ComponentLink3Description: Package Specification; PackageDescription: 3-Pin Small Outline Transistor, Body 2.92 x 1.3 mm, Pitch 0.95 mm; RoHS: Pb-Free; PackageReference: SOT-23-3-318-08; Packing: Tape and Reel; PackageVersion: Rev. AP, 11/2009; PartNumber: MMBZ5227BLT1G; ComponentLink2Description: Datasheet; ComponentLink2URL: http://www.onsemi.cn/pub_link/Collateral/MMBZ5221BLT1-D.PDF; DatasheetVersion: Rev. 12; ComponentLink3URL: http://www.onsemi.cn/pub_link/Collateral/318-08.PDF; Mounting Technology: Surface Mount; ComponentLink4Description: Buy; ComponentLink4URL: https://www.mouser.lt/ProductDetail/onsemi/MMBZ5227BLT1G?qs=P4IOph%252Bbot%252Bc24HkQGoTVg%3D%3D
J10 J11 = CMP-15831-000009-1: as J8 on sheet Computation; ComponentLink2URL: https://cdn.harwin.com/pdfs/M20-999.pdf; ComponentLink2Description: Datasheet; Package: M20-9990246; Temperature: -40°C to +105°C; Octopart: https://octopart.com/m20-9990246-harwin-2590635; Mouser Description: 2.54mm (0.1") Pitch SIL Vertical PC Tail Pin Header, 6.1mm mating pin height, tin, 2 contacts; Temperature Range High: +105°C; Device Class L1: Connectors; RoHS: TRUE; Automotive: No; Height: 8.99mm; Number Of Rows: 1; Contact Material: Tin,Nickel; Category: Conn; Pitch: 2.54mm; Lead Free: Yes; Digikey Description: CONN HEADER VERT 2POS 2.54MM; Manufacturer Part Number: M20-9990246; Temperature Range Low: -40°C; Device Class L3: unset; Device Class L2: Headers and Wire Housings
P3 = CMP-1502-01064-1: THT Vertical Pin Header WR-PHD, Pitch 2.54 mm, Single Row, 4 pins; Manufacturer: Wurth Elektronik; Withstanding Voltage: 500VAC; Rated Current: 3A; Working Voltage: 250VAC; Pin Number: 4; Gender: Male; Contact Resistance: 20mOhm; Pitch: 2.54mm; Manufacturer URL: http://www.we-online.de; Operating Temperature: -40to105degC; Packaging: Bag; Mounting Technology: THT; Package Reference: 61300411121; Datasheet URL: https://katalog.we-online.de/em/datasheet/6130xx11121.pdf; Publisher: WurthElektronik; Part Number: 61300411121; Row Number: Single; Orientation: Vertical
R16-R22 = Resistor_0402: 0402 resistor

## Nets that join several sheets
3V3: 1 (C27_1.2 U1_1.5), 2 (C27_2.2 U1_2.5), Connectors (10 pins), Computation (14 pins), Memory (8 pins)
3V3_PWR_PCB: Connectors (*1.1 C5.1), Computation (9 pins), External_boards (*2.41 *2.42)
GND: 1 (C23_1.1 C24_1.1 R11_1.1), 1 (C26_1.1 C27_1.1 R13_1.1 U1_1.2), 2 (C23_2.1 C24_2.1 R11_2.1), 2 (C26_2.1 C27_2.1 R13_2.1 U1_2.2), Connectors (38 pins), Computation (44 pins), Memory (6 pins), External_boards (19 pins)
ANALOG_INA: 1 (R10_1.1), Connectors (J7.1)
ANALOG_INB: 2 (R10_2.1), Connectors (J3.1)
NetC24_1_2: 1 (C24_1.2 L1_1.2), 1 (U1_1.3)
NetC24_2_2: 2 (C24_2.2 L1_2.2), 2 (U1_2.3)
NetC25_1_1: 1 (C25_1.1), Computation (IC2.3)
NetC25_2_1: 2 (C25_2.1), Computation (IC2.9)
NetC26_1_2: 1 (C26_1.2), Computation (IC2.4)
NetC26_2_2: 2 (C26_2.2), Computation (IC2.10)

## Assembly variants
Variant of FPGA_ADC_SHIELD_PCB2: not fitted R11_1 R11_2